# Altium schematic sheet ATGM332D-5NR321_ATGM332D-5NR32.schdoc
size 127 x 99 mm
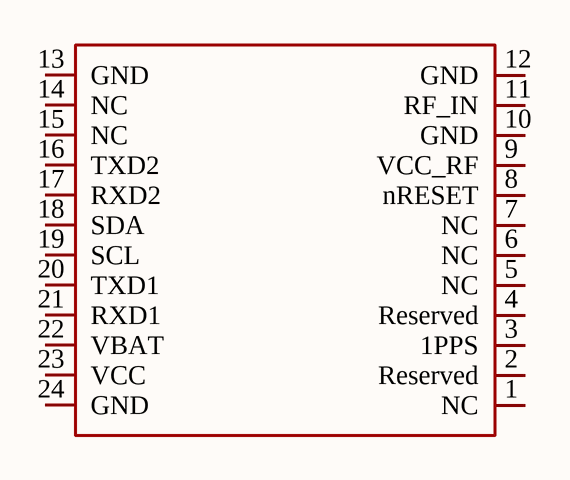
[diagram p0: ATGM332D-5NR321_ATGM332D-5NR32.schdoc]

## Parts
U?  ATGM332D-5NR32  [GSM-SMD_ATGM332D-5N11]  (value not drawn)

## Nets

Not connected (* = marked no-connect by the designer): U? 1(NC) 2(Reserved) 3(1PPS) 4(Reserved) 5(NC) 6(NC) 7(NC) 8(nRESET) 9(VCC_RF) 10(GND) 11(RF_IN) 12(GND) 13(GND) 14(NC) 15(NC) 16(TXD2) 17(RXD2) 18(SDA) 19(SCL) 20(TXD1) 21(RXD1) 22(VBAT) 23(VCC) 24(GND)

## Library data of the parts
U? = ATGM332D-5NR32: Manufacturer: 杭州中科微; Add into BOM: yes; Symbol: ATGM332D-5NR32; Device: ATGM332D-5NR32; LCSC Part Name: BDS/GNSS 全星座定位导航模块; Supplier Part: C3037611; Manufacturer Part: ATGM332D-5NR32; Supplier Footprint: -; JLCPCB Part Class: Extended Part; Datasheet: https://item.szlcsc.com/datasheet/ATGM332D-5NR32/3589230.html; Supplier: LCSC; Convert to PCB: yes